# Altium schematic sheet slave.SchDoc
size A3; DocumentNumber: 4; SheetNumber: 4; SheetTotal: 9
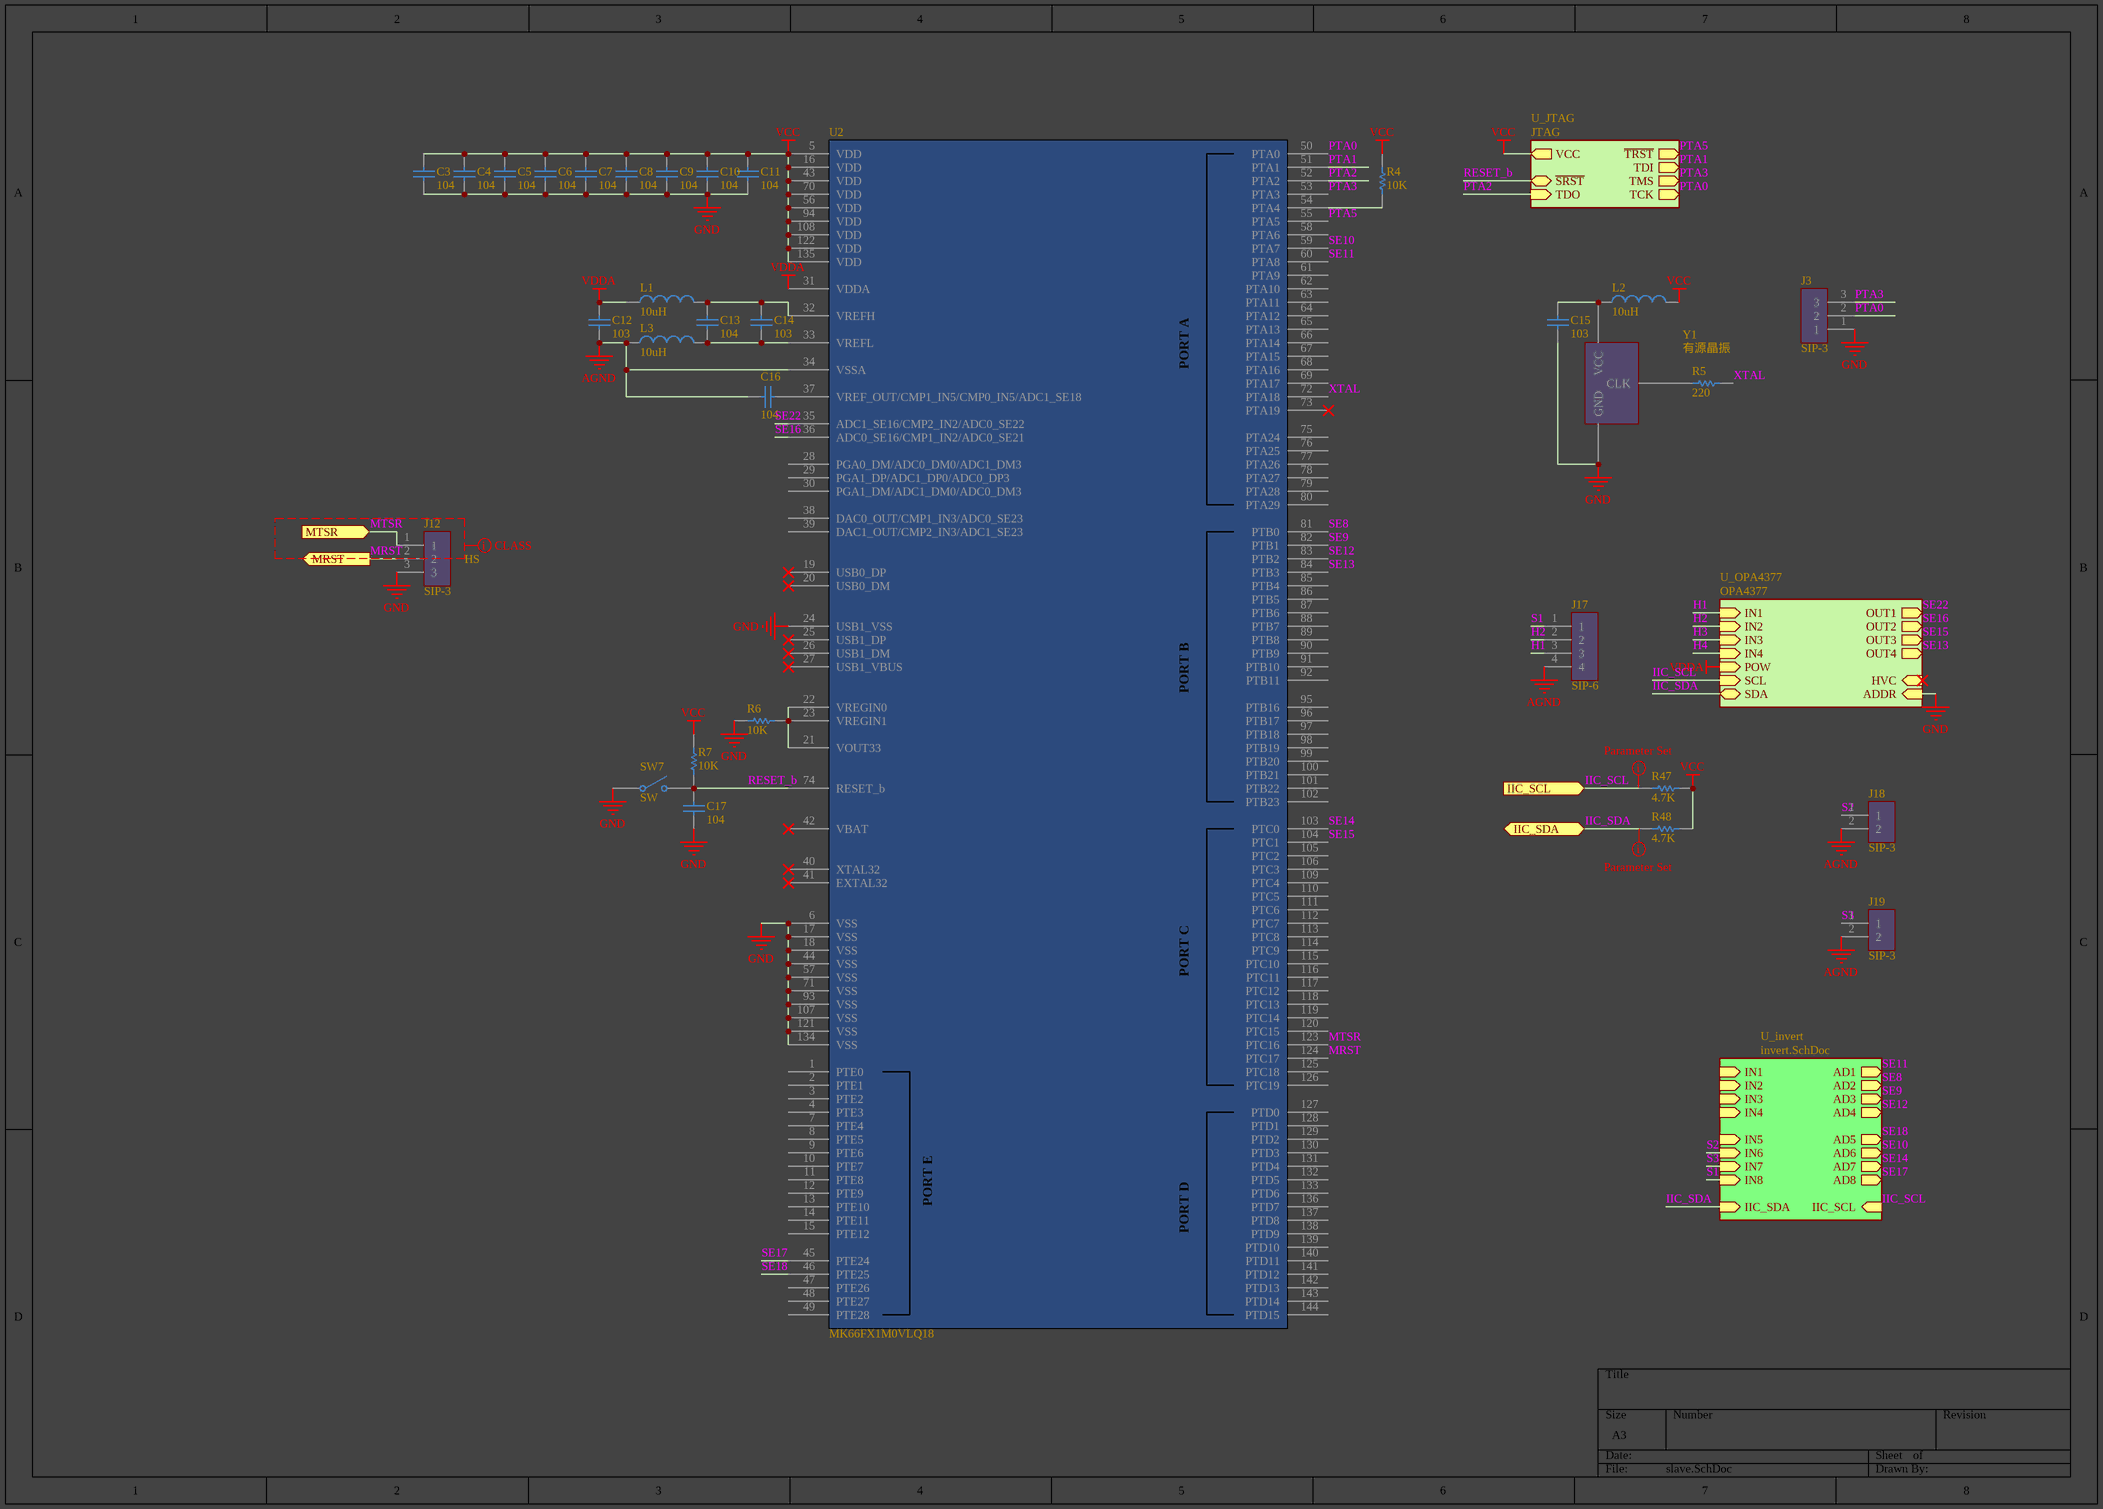
[diagram p0: slave.SchDoc]

## Parts
C3  104  [C0603]
C4  104  [C0603]
C5  104  [C0603]
C6  104  [C0603]
C7  104  [C0603]
C8  104  [C0603]
C9  104  [C0603]
C10  104  [C0603]
C11  104  [C0603]
C12  103  [C0603]
C13  104  [C0603]
C14  103  [C0603]
C15  103  [C0603]
C16  104  [C0402]
C17  104  [C0603]
J3  SIP-3  [2.0排针3P]
J12  SIP-3  [2.0排针3P]
J17  SIP-6  [2.0排针4P]
J18  SIP-3  [GH1.25-2P]
J19  SIP-3  [GH1.25-2P]
L1  10uH  [L0603]
L2  10uH  [L0603]
L3  10uH  [L0603]
R4  10K  [R0603]
R5  220  [R0402]
R6  10K  [R0603]
R7  10K  [R0603]
R47  4.7K  [R0603]
R48  4.7K  [R0603]
SW7  SW  [按键微动开关2]
U2  MK66FX1M0VLQ18  [LQFP144 20X20]
Y1  有源晶振  [OSC 5032-4P]

## Sub-sheets
U_invert = invert.SchDoc: AD1 (out), AD2 (out), AD3 (out), AD4 (out), AD5 (out), AD6 (out), AD7 (out), AD8 (out), IN8 (in), IN7 (in), IN6 (in), IN5 (in), IN4 (in), IN3 (in), IN2 (in), IN1 (in), IIC_SCL (in), IIC_SDA (in)
U_JTAG = JTAG: TDO (in), ~{SRST} (bidir), ~{TRST} (out), TDI (out), TMS (out), TCK (out), VCC (out)
U_OPA4377 = OPA4377: IN1 (in), IN2 (in), IN3 (in), IN4 (in), OUT1 (out), OUT2 (out), OUT3 (out), OUT4 (out), POW (in), SCL (in), SDA (bidir), ADDR (in), HVC (in)

## Ports
IIC_SCL (in), IIC_SDA (bidir), MRST (out), MTSR (in)

## Nets
AGND: C12.1 C16.1 J17.4 J18.2 J19.2 L3.1 U2.34(VSSA)
GND: C3.1 C4.1 C5.1 C6.1 C7.1 C8.1 C9.1 C10.1 C11.1 C15.1 C17.1 J3.1 J12.3 R6.2 SW7.1(COMMON) U2.6(VSS) U2.17(VSS) U2.18(VSS) U2.24(USB1_VSS) U2.44(VSS) U2.57(VSS) U2.71(VSS) U2.93(VSS) U2.107(VSS) U2.121(VSS) U2.134(VSS) Y1.2(GND) ; sheet U_OPA4377/ADDR
VCC: C3.2 C4.2 C5.2 C6.2 C7.2 C8.2 C9.2 C10.2 C11.2 L2.2 R4.1 R7.2 R47.1 R48.1 U2.5(VDD) U2.16(VDD) U2.43(VDD) U2.56(VDD) U2.70(VDD) U2.94(VDD) U2.108(VDD) U2.122(VDD) U2.135(VDD) ; sheet U_JTAG/VCC
VDDA: C12.2 L1.1 U2.31(VDDA) ; sheet U_OPA4377/POW
H1: J17.3 ; sheet U_OPA4377/IN1
H2: J17.2 ; sheet U_OPA4377/IN2
H3: sheet U_OPA4377/IN3
H4: sheet U_OPA4377/IN4
IIC_SCL: R47.2 ; port IIC_SCL, sheet U_invert/IIC_SCL, sheet U_OPA4377/SCL
IIC_SDA: R48.2 ; port IIC_SDA, sheet U_invert/IIC_SDA, sheet U_OPA4377/SDA
MRST: J12.2 U2.124(PTC17) ; port MRST
MTSR: J12.1 U2.123(PTC16) ; port MTSR
PTA0: J3.2 U2.50(PTA0) ; sheet U_JTAG/TCK
PTA1: U2.51(PTA1) ; sheet U_JTAG/TDI
PTA2: U2.52(PTA2) ; sheet U_JTAG/TDO
PTA3: J3.3 U2.53(PTA3) ; sheet U_JTAG/TMS
PTA5: U2.55(PTA5) ; sheet U_JTAG/~{TRST}
RESET_b: C17.2 R7.1 SW7.2(NO) U2.74(RESET_b) ; sheet U_JTAG/~{SRST}
S1: J17.1 ; sheet U_invert/IN8
S2: J18.1 ; sheet U_invert/IN6
S3: J19.1 ; sheet U_invert/IN7
SE8: U2.81(PTB0) ; sheet U_invert/AD2
SE9: U2.82(PTB1) ; sheet U_invert/AD3
SE10: U2.59(PTA7) ; sheet U_invert/AD6
SE11: U2.60(PTA8) ; sheet U_invert/AD1
SE12: U2.83(PTB2) ; sheet U_invert/AD4
SE13: U2.84(PTB3) ; sheet U_OPA4377/OUT4
SE14: U2.103(PTC0) ; sheet U_invert/AD7
SE15: U2.104(PTC1) ; sheet U_OPA4377/OUT3
SE16: U2.36(ADC0_SE16/CMP1_IN2/ADC0_SE21) ; sheet U_OPA4377/OUT2
SE17: U2.45(PTE24) ; sheet U_invert/AD8
SE18: U2.46(PTE25) ; sheet U_invert/AD5
SE22: U2.35(ADC1_SE16/CMP2_IN2/ADC0_SE22) ; sheet U_OPA4377/OUT1
XTAL: R5.1 U2.72(PTA18)
NetC13_1: C13.1 C14.1 L3.2 U2.33(VREFL)
NetC13_2: C13.2 C14.2 L1.2 U2.32(VREFH)
NetC15_2: C15.2 L2.1 Y1.4(VCC)
NetC16_2: C16.2 U2.37(VREF_OUT/CMP1_IN5/CMP0_IN5/ADC1_SE18)
NetR4_2: R4.2 U2.54(PTA4)
NetR5_2: R5.2 Y1.3(CLK)
NetR6_1: R6.1 U2.21(VOUT33) U2.22(VREGIN0) U2.23(VREGIN1)

Not connected (* = marked no-connect by the designer): U2 1(PTE0) 2(PTE1) 3(PTE2) 4(PTE3) 7(PTE4) 8(PTE5) 9(PTE6) 10(PTE7) 11(PTE8) 12(PTE9) 13(PTE10) 14(PTE11) 15(PTE12) 19(USB0_DP)* 20(USB0_DM)* 25(USB1_DP)* 26(USB1_DM)* 27(USB1_VBUS)* 28(PGA0_DM/ADC0_DM0/ADC1_DM3) 29(PGA1_DP/ADC1_DP0/ADC0_DP3) 30(PGA1_DM/ADC1_DM0/ADC0_DM3) 38(DAC0_OUT/CMP1_IN3/ADC0_SE23) 39(DAC1_OUT/CMP2_IN3/ADC1_SE23) 40(XTAL32)* 41(EXTAL32)* 42(VBAT)* 47(PTE26) 48(PTE27) 49(PTE28) 58(PTA6) 61(PTA9) 62(PTA10) 63(PTA11) 64(PTA12) 65(PTA13) 66(PTA14) 67(PTA15) 68(PTA16) 69(PTA17) 73(PTA19)* 75(PTA24) 76(PTA25) 77(PTA26) 78(PTA27) 79(PTA28) 80(PTA29) 85(PTB4) 86(PTB5) 87(PTB6) 88(PTB7) 89(PTB8) 90(PTB9) 91(PTB10) 92(PTB11) 95(PTB16) 96(PTB17) 97(PTB18) 98(PTB19) 99(PTB20) 100(PTB21) 101(PTB22) 102(PTB23) 105(PTC2) 106(PTC3) 109(PTC4) 110(PTC5) 111(PTC6) 112(PTC7) 113(PTC8) 114(PTC9) 115(PTC10) 116(PTC11) 117(PTC12) 118(PTC13) 119(PTC14) 120(PTC15) 125(PTC18) 126(PTC19) 127(PTD0) 128(PTD1) 129(PTD2) 130(PTD3) 131(PTD4) 132(PTD5) 133(PTD6) 136(PTD7) 137(PTD8) 138(PTD9) 139(PTD10) 140(PTD11) 141(PTD12) 142(PTD13) 143(PTD14) 144(PTD15)

## Layout directives
net class HS: IIC_SCL, IIC_SDA, MRST, MTSR

## Notes on the sheet
- (in symbol MK66) PORT A; PORT B; PORT C; PORT E; PORT D

## Library data of the parts
C3-C17 = 电容: Capacitor; Value: 22pF; Published: 8-Jun-2000; LatestRevisionDate: 17-Jul-2002; LatestRevisionNote: Re-released for DXP Platform.; PackageReference: RAD-0.3; Publisher: Altium Limited; PackageDescription: Radial Cap, Thru-Hole; 2 Leads; 0.3 in Pin Spacing
J17 = SIP-4
J18 J19 = SIP-2
L1-L3 = 电感
R4-R7 R47 R48 = 电阻: Resistor; Value: 150R; Published: 8-Jun-2000; LatestRevisionDate: 17-Jul-2002; LatestRevisionNote: Re-released for DXP Platform.; PackageReference: AXIAL-0.3; Publisher: Altium Limited; PackageDescription: Axial Device, Thru-Hole; 2 Leads; 0.3 in Pin Spacing
SW7 = Switch: Single-Pole, Single-Throw Switch
U2 = MK66